# EasyEDA Pro project orangepi-util-40pin.epro

# Schematic Schematic1
Board Name: Board1; Create Date: 2025-11-03; Page Name: P1; Project Name: orangepi-util; Schematic Name: Schematic1; Update Date: 2025-11-03; Company: 嘉立创EDA; Page Size: A4; Version: V1.0
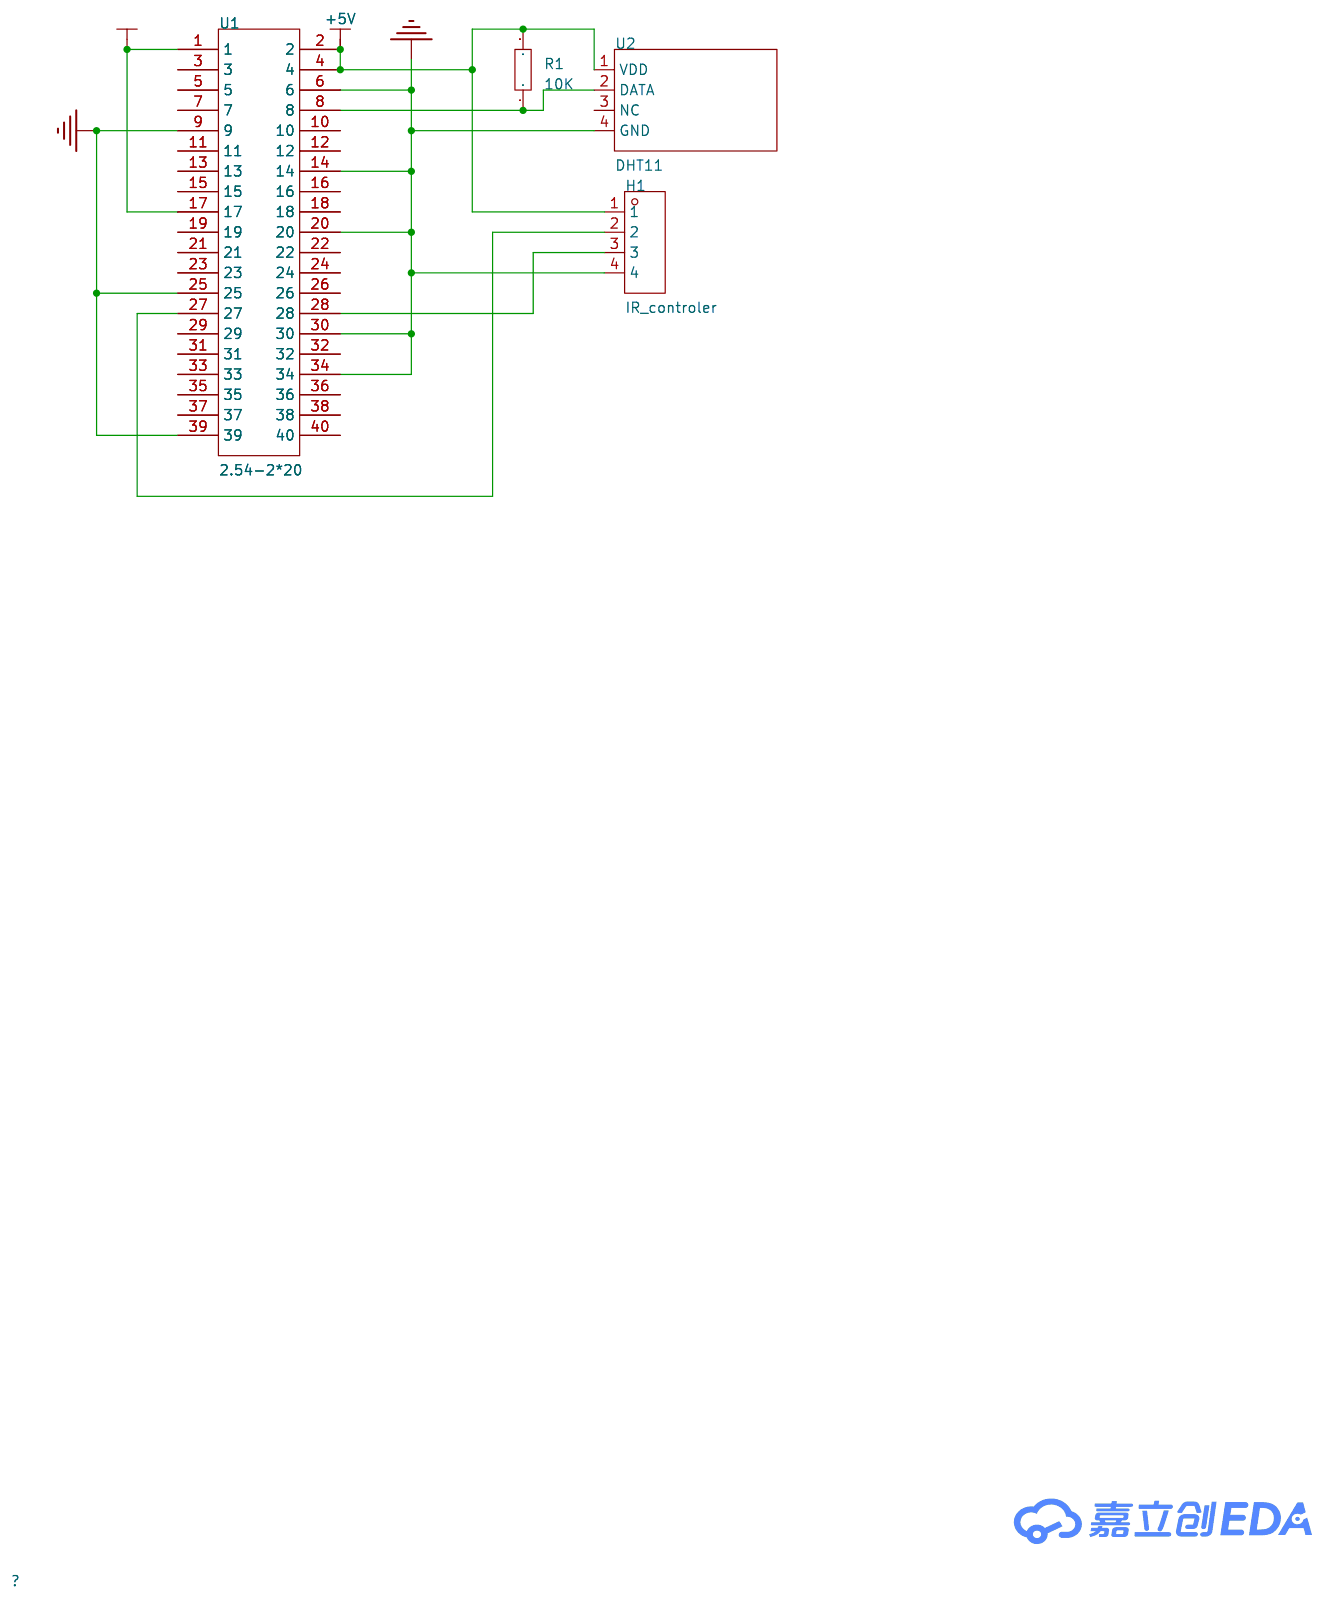
[diagram p0: schematic sheet]

## Parts
H1  IR_controler  [HDR-TH_4P-P2.54-V-M]
R1  10K  [R0603]
U1  2.54-2*20  [HDR-TH_40P-P2.54-V-F-R2-C20-S2.54]
U2  DHT11  [SENSOR-TH_DHT11]

## Library data of the parts
H1 = PZ254V-11-04P: 插针结构:1x4P;间距:2.54mm;行距:-;圆针/方针:方针;安装方式:直插;排数:单排;总PIN位数:4P;额定电流:3A;额定电压:250V;配合针长度:6mm;塑高:2.5mm;端接针长度:3mm;触头材质:-;工作温度:-40℃~+105℃;颜色:黑色;; LCSC Part Name: 1x4P 间距:2.54mm 方针 直插; Supplier Part: C2691448; Manufacturer: XFCN(兴飞); Supplier Footprint: 插件,P=2.54mm; JLCPCB Part Class: 扩展库; Datasheet: https://item.szlcsc.com/datasheet/PZ254V-11-04P/2801085.html; Supplier: LCSC; Pin Structure: 1x4P; Pitch: 2.54mm; Circluar Pins/Square Pins: 方针; Mounting Type: 直插; Number of Rows: 单排; Number of Pins: 4P; Current Rating: 3A; Voltage Rating (Max): 250V; Length of Mating Pin: 6mm; Insulation Height: 2.5mm; Length of End Connection Pin: 3mm; Operating Temperature: -40℃~+105℃; Color: 黑色
R1 = Res_0603: Supplier Footprint: 0603
U1 = 2.54-2*20: 插孔结构:2x20P;间距:2.54mm;行距:2.54mm;圆孔/方孔:方孔;安装方式:直插;排数:双排;总孔位数:40P;额定电流:2.5A;额定电压:-;插孔方向:顶部;塑高:8.5mm;工作温度:-40℃~+105℃;; LCSC Part Name: 间距:2.54mm 2x20P 直插; Supplier Part: C2977589; Manufacturer: ZHOURI(洲日); Supplier Footprint: 插件,P=2.54mm; JLCPCB Part Class: 扩展库; Datasheet: https://item.szlcsc.com/datasheet/2.54-2*20/3388941.html; Supplier: LCSC; Holes Structure: 2x20P; Pitch: 2.54mm; Row Spacing: 2.54mm; Circular Hole / Square Hole: 方孔; Mounting Type: 直插; Number of Rows: 双排; Number of Positions: 40P; Current Rating: 2.5A; Holes Direction: 顶部; Insulation Height: 8.5mm; Operating Temperature: -40℃~+105℃
U2 = DHT11: 新款电容式数字温湿度传感器,老款已停产16.1x12.6x5.8mm; LCSC Part Name: 新款电容式数字温湿度传感器,老款已停产16.1x12.6x5.8mm DHT11  电容式传感器; Supplier Part: C117051; Manufacturer: 广州奥松; Supplier Footprint: SIP-4; JLCPCB Part Class: 扩展库; Datasheet: https://atta.szlcsc.com/upload/public/pdf/source/20170703/1499081238365.pdf; Supplier: LCSC

## Nets
+3.3V: U1.1 U1.17
+5V: H1.1 R1.2 U1.2 U1.4 U2.1(VDD)
GND: H1.4 U1.6 U1.9 U1.14 U1.20 U1.25 U1.30 U1.34 U1.39 U2.4(GND)
Net-(H1-2): H1.2 U1.27
Net-(H1-3): H1.3 U1.28
Net-(R1-1): R1.1 U1.8 U2.2(DATA)

Not connected (* = marked no-connect by the designer): U1 3 5 7 10 11 12 13 15 16 18 19 21 22 23 24 26 29 31 32 33 35 36 37 38 40; U2 3(NC)
